# EAGLE design picoKey_230407 (EAGLE 9.6.2)
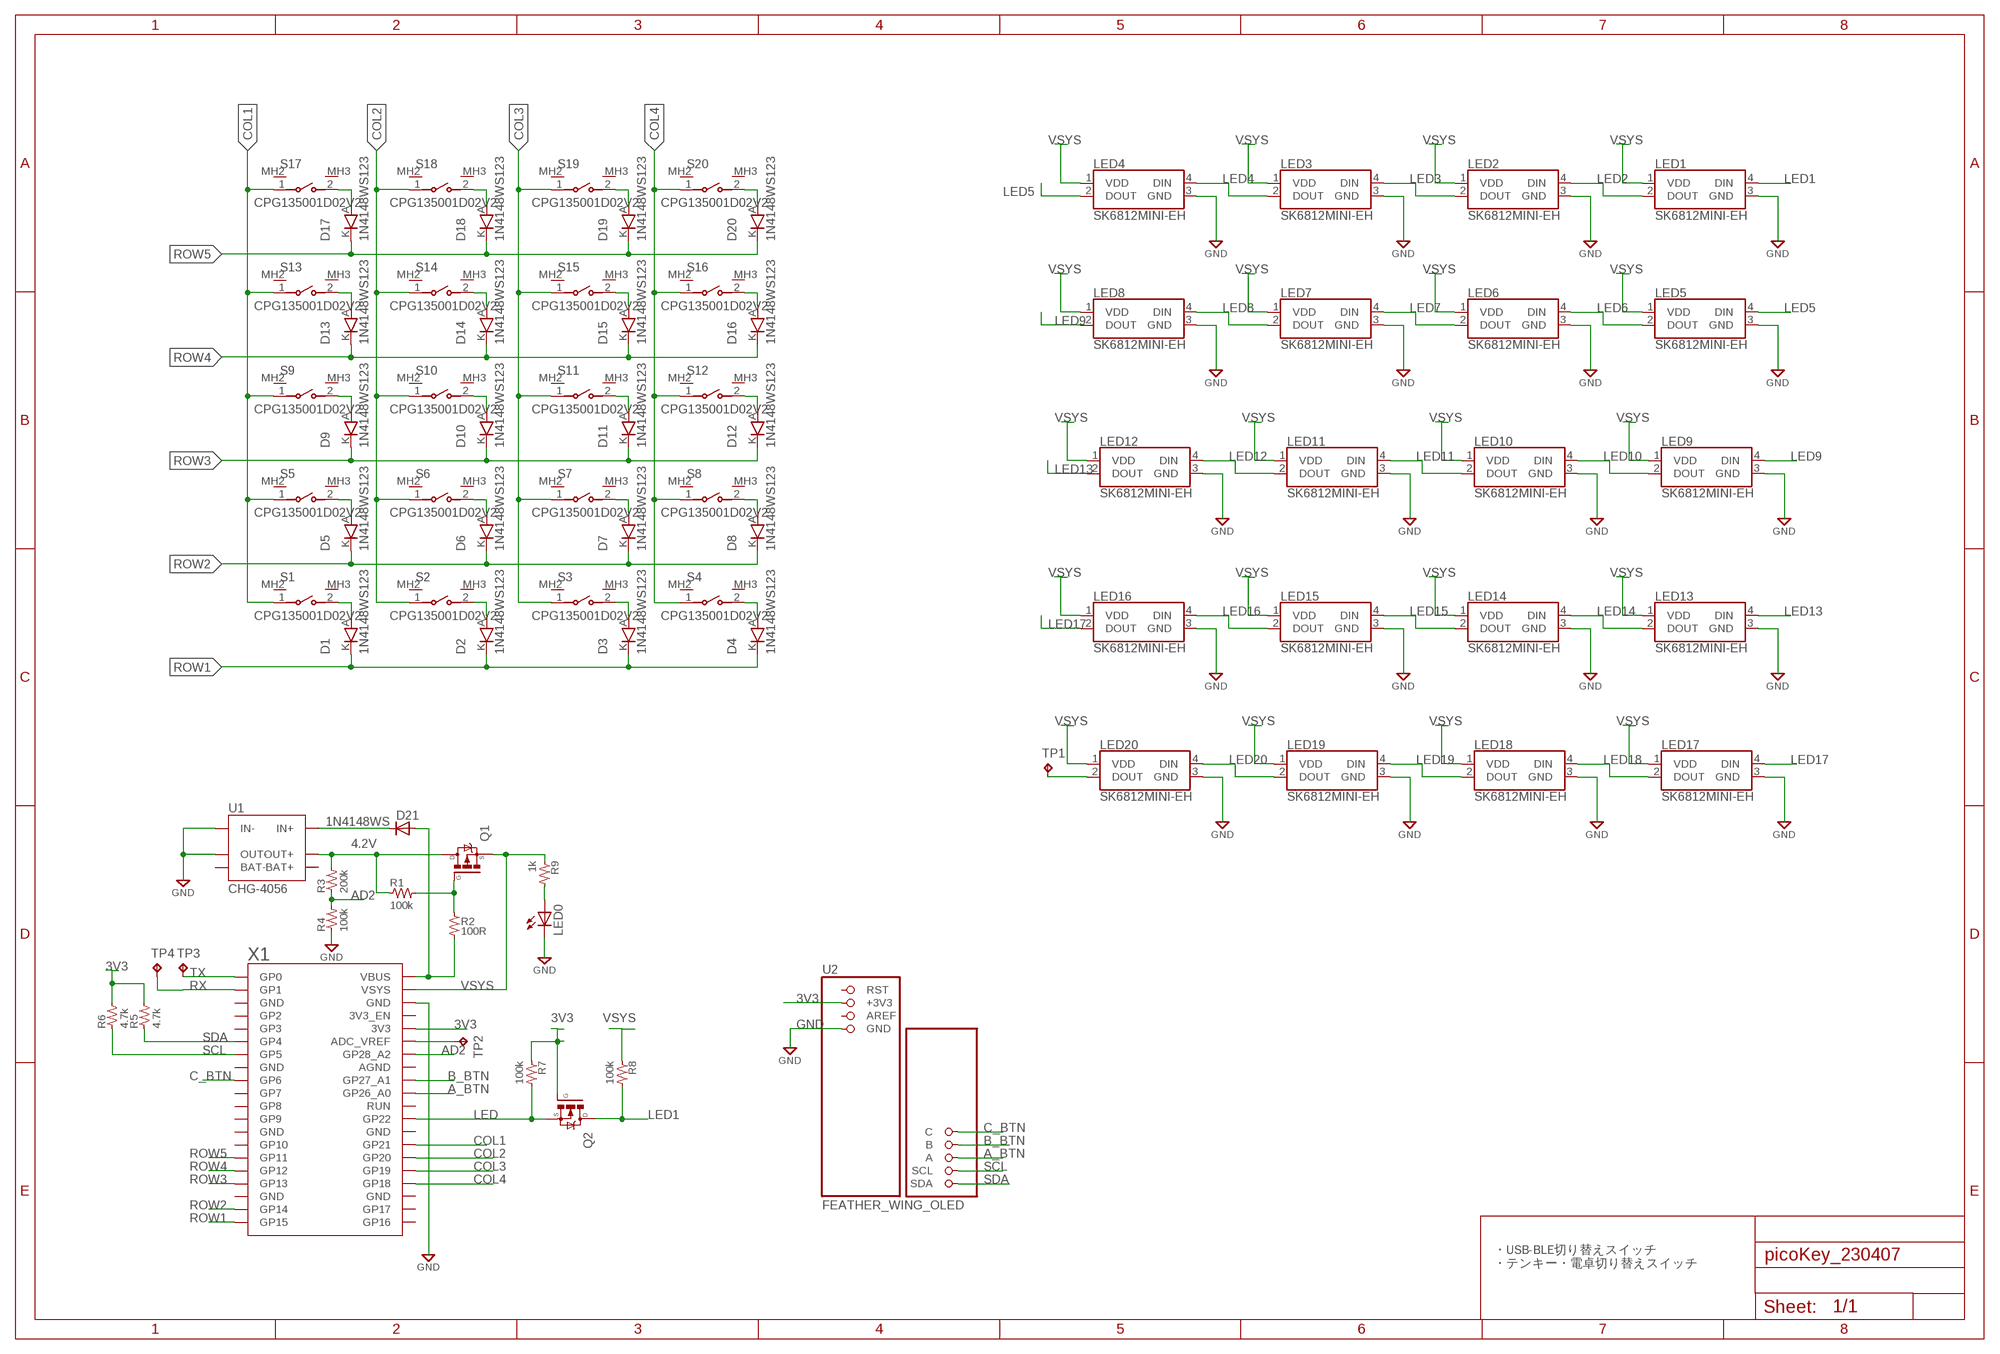
[diagram p0: schematic, sheet 1]

## Parts
D1  1N4148WS123  [SOD-123]
D2  1N4148WS123  [SOD-123]
D3  1N4148WS123  [SOD-123]
D4  1N4148WS123  [SOD-123]
D5  1N4148WS123  [SOD-123]
D6  1N4148WS123  [SOD-123]
D7  1N4148WS123  [SOD-123]
D8  1N4148WS123  [SOD-123]
D9  1N4148WS123  [SOD-123]
D10  1N4148WS123  [SOD-123]
D11  1N4148WS123  [SOD-123]
D12  1N4148WS123  [SOD-123]
D13  1N4148WS123  [SOD-123]
D14  1N4148WS123  [SOD-123]
D15  1N4148WS123  [SOD-123]
D16  1N4148WS123  [SOD-123]
D17  1N4148WS123  [SOD-123]
D18  1N4148WS123  [SOD-123]
D19  1N4148WS123  [SOD-123]
D20  1N4148WS123  [SOD-123]
D21  1N4148WS  DIODE123  [SOD-123]
LED0  LEDCHIP-LED0603  [CHIP-LED0603]
LED1  SK6812MINI-EH  [SK6812MINIE-H]
LED2  SK6812MINI-EH  [SK6812MINIE-H]
LED3  SK6812MINI-EH  [SK6812MINIE-H]
LED4  SK6812MINI-EH  [SK6812MINIE-H]
LED5  SK6812MINI-EH  [SK6812MINIE-H]
LED6  SK6812MINI-EH  [SK6812MINIE-H]
LED7  SK6812MINI-EH  [SK6812MINIE-H]
LED8  SK6812MINI-EH  [SK6812MINIE-H]
LED9  SK6812MINI-EH  [SK6812MINIE-H]
LED10  SK6812MINI-EH  [SK6812MINIE-H]
LED11  SK6812MINI-EH  [SK6812MINIE-H]
LED12  SK6812MINI-EH  [SK6812MINIE-H]
LED13  SK6812MINI-EH  [SK6812MINIE-H]
LED14  SK6812MINI-EH  [SK6812MINIE-H]
LED15  SK6812MINI-EH  [SK6812MINIE-H]
LED16  SK6812MINI-EH  [SK6812MINIE-H]
LED17  SK6812MINI-EH  [SK6812MINIE-H]
LED18  SK6812MINI-EH  [SK6812MINIE-H]
LED19  SK6812MINI-EH  [SK6812MINIE-H]
LED20  SK6812MINI-EH  [SK6812MINIE-H]
Q1  MOSFET-P  [SOT-23]
Q2  MOSFET-NSOT-23  [SOT-23]
R1  100k  R_0603  [R0603]
R2  100R  R_0603  [R0603]
R3  200k  R_0603  [R0603]
R4  100k  R_0603  [R0603]
R5  4.7k  R_0603  [R0603]
R6  4.7k  R_0603  [R0603]
R7  100k  R_0603  [R0603]
R8  100k  R_0603  [R0603]
R9  1k  R_0603  [R0603]
S1  CPG135001D02V2  [KAILH_CHOC_V2]
S2  CPG135001D02V2  [KAILH_CHOC_V2]
S3  CPG135001D02V2  [KAILH_CHOC_V2]
S4  CPG135001D02V2  [KAILH_CHOC_V2]
S5  CPG135001D02V2  [KAILH_CHOC_V2]
S6  CPG135001D02V2  [KAILH_CHOC_V2]
S7  CPG135001D02V2  [KAILH_CHOC_V2]
S8  CPG135001D02V2  [KAILH_CHOC_V2]
S9  CPG135001D02V2  [KAILH_CHOC_V2]
S10  CPG135001D02V2  [KAILH_CHOC_V2]
S11  CPG135001D02V2  [KAILH_CHOC_V2]
S12  CPG135001D02V2  [KAILH_CHOC_V2]
S13  CPG135001D02V2  [KAILH_CHOC_V2]
S14  CPG135001D02V2  [KAILH_CHOC_V2]
S15  CPG135001D02V2  [KAILH_CHOC_V2]
S16  CPG135001D02V2  [KAILH_CHOC_V2]
S17  CPG135001D02V2  [KAILH_CHOC_V2]
S18  CPG135001D02V2  [KAILH_CHOC_V2]
S19  CPG135001D02V2  [KAILH_CHOC_V2]
S20  CPG135001D02V2  [KAILH_CHOC_V2]
TP1  TPTP06R  [TP06R]
TP2  TPTP06R  [TP06R]
TP3  TPTP06R  [TP06R]
TP4  TPTP06R  [TP06R]
U1  CHG-4056  [CHG-4056]
U2  FEATHER_WING_OLED  [FEATHER_WING_OLED]
X1  RASPBERRYPI_PICO_RPI_PICO_MY-MY  [RASPBERRYPI_PICO_RPI_PICO_MY]

## Nets
3V3: Q2.3(G) R5.2 R6.2 R7.1 U2.15(+3V3) X1.3V3
4.2V: Q1.2(D) R1.1 R3.2 U1.OUT+
A_BTN: U2.26(A) X1.GP26_A0
AD2: R3.1 R4.2 X1.GP28_A2
B_BTN: U2.25(B) X1.GP27_A1
C_BTN: U2.24(C) X1.GP6
COL1: S1.1 S5.1 S9.1 S13.1 S17.1 X1.GP21
COL2: S2.1 S6.1 S10.1 S14.1 S18.1 X1.GP20
COL3: S3.1 S7.1 S11.1 S15.1 S19.1 X1.GP19
COL4: S4.1 S8.1 S12.1 S16.1 S20.1 X1.GP18
GND: LED0.C LED1.3(GND) LED2.3(GND) LED3.3(GND) LED4.3(GND) LED5.3(GND) LED6.3(GND) LED7.3(GND) LED8.3(GND) LED9.3(GND) LED10.3(GND) LED11.3(GND) LED12.3(GND) LED13.3(GND) LED14.3(GND) LED15.3(GND) LED16.3(GND) LED17.3(GND) LED18.3(GND) LED19.3(GND) LED20.3(GND) R4.1 U1.IN- U1.OUT- U2.13(GND) X1.GND@8(GND) ; supply symbol labelled G
LED: Q2.1(S) R7.2 X1.GP22
LED1: LED1.4(DIN) Q2.2(D) R8.2
LED2: LED1.2(DOUT) LED2.4(DIN)
LED3: LED2.2(DOUT) LED3.4(DIN)
LED4: LED3.2(DOUT) LED4.4(DIN)
LED5: LED4.2(DOUT) LED5.4(DIN)
LED6: LED5.2(DOUT) LED6.4(DIN)
LED7: LED6.2(DOUT) LED7.4(DIN)
LED8: LED7.2(DOUT) LED8.4(DIN)
LED9: LED8.2(DOUT) LED9.4(DIN)
LED10: LED9.2(DOUT) LED10.4(DIN)
LED11: LED10.2(DOUT) LED11.4(DIN)
LED12: LED11.2(DOUT) LED12.4(DIN)
LED13: LED12.2(DOUT) LED13.4(DIN)
LED14: LED13.2(DOUT) LED14.4(DIN)
LED15: LED14.2(DOUT) LED15.4(DIN)
LED16: LED15.2(DOUT) LED16.4(DIN)
LED17: LED16.2(DOUT) LED17.4(DIN)
LED18: LED17.2(DOUT) LED18.4(DIN)
LED19: LED18.2(DOUT) LED19.4(DIN)
LED20: LED19.2(DOUT) LED20.4(DIN)
N$5: D1.A S1.2
N$6: D2.A S2.2
N$7: D3.A S3.2
N$8: D4.A S4.2
N$9: D5.A S5.2
N$10: D6.A S6.2
N$11: D7.A S7.2
N$12: D8.A S8.2
N$13: D9.A S9.2
N$14: D10.A S10.2
N$15: D11.A S11.2
N$16: D12.A S12.2
N$17: D13.A S13.2
N$18: D14.A S14.2
N$19: D15.A S15.2
N$20: D16.A S16.2
N$21: D17.A S17.2
N$22: D18.A S18.2
N$23: LED0.A R9.2
N$24: D20.A S20.2
N$25: D19.A S19.2
N$30: D21.A R2.2 X1.VBUS
N$32: D21.K(C) U1.IN+
N$36: Q1.3(G) R1.2 R2.1
N$38: LED20.2(DOUT) TP1.TP
N$40: TP2.TP X1.ADC_VREF
ROW1: D1.K D2.K D3.K D4.K X1.GP15
ROW2: D5.K D6.K D7.K D8.K X1.GP14
ROW3: D9.K D10.K D11.K D12.K X1.GP13
ROW4: D13.K D14.K D15.K D16.K X1.GP12
ROW5: D17.K D18.K D19.K D20.K X1.GP11
RX: TP4.TP X1.GP1
SCL: R6.1 U2.27(SCL) X1.GP5
SDA: R5.1 U2.28(SDA) X1.GP4
TX: TP3.TP X1.GP0
VSYS: LED1.1(VDD) LED2.1(VDD) LED3.1(VDD) LED4.1(VDD) LED5.1(VDD) LED6.1(VDD) LED7.1(VDD) LED8.1(VDD) LED9.1(VDD) LED10.1(VDD) LED11.1(VDD) LED12.1(VDD) LED13.1(VDD) LED14.1(VDD) LED15.1(VDD) LED16.1(VDD) LED17.1(VDD) LED18.1(VDD) LED19.1(VDD) LED20.1(VDD) Q1.1(S) R8.1 R9.1 X1.VSYS
Unconnected: S1.MH2(MH) S1.MH3(MH) S2.MH2(MH) S2.MH3(MH) S3.MH2(MH) S3.MH3(MH) S4.MH2(MH) S4.MH3(MH) S5.MH2(MH) S5.MH3(MH) S6.MH2(MH) S6.MH3(MH) S7.MH2(MH) S7.MH3(MH) S8.MH2(MH) S8.MH3(MH) S9.MH2(MH) S9.MH3(MH) S10.MH2(MH) S10.MH3(MH) S11.MH2(MH) S11.MH3(MH) S12.MH2(MH) S12.MH3(MH) S13.MH2(MH) S13.MH3(MH) S14.MH2(MH) S14.MH3(MH) S15.MH2(MH) S15.MH3(MH) S16.MH2(MH) S16.MH3(MH) S17.MH2(MH) S17.MH3(MH) S18.MH2(MH) S18.MH3(MH) S19.MH2(MH) S19.MH3(MH) S20.MH2(MH) S20.MH3(MH) U1.BAT+ U1.BAT- U2.14(AREF) U2.16(RST) X1.3V3_EN X1.AGND X1.GND@1(GND) X1.GND@2(GND) X1.GND@3(GND) X1.GND@4(GND) X1.GND@6(GND) X1.GND@7(GND) X1.GP2 X1.GP3 X1.GP7 X1.GP8 X1.GP9 X1.GP10 X1.GP16 X1.GP17 X1.RUN

## Notes on the sheet
- ・USB-BLE切り替えスイッチ
  ・テンキー・電卓切り替えスイッチ

## Library data of the parts
D1-D20 = SamacSys_Parts:1N4148WS: ON Semiconductor Switching Diode, 300mA 75V, 2-Pin SOD-323 1N4148WS Source: Datasheet
D21 = Miya_IC:DIODE: Diode
LED0 = Miya_IC:LED: LED OSRAM: - CHIPLED LG R971, LG N971, LY N971, LG Q971, LY Q971, LO R971, LY R971 LH N974, LH R974 LS Q976, LO Q976, LY Q976 LO Q996 - Hyper CHIPLED LW Q18S LB Q993, LB Q99A, LB R99A - SideLED LS A670, LO A670, LY A670, LG A670, LP A670 LB A673, LV A673, LT A673, LW A673 LH A674 LY A675 LS A676, LA A676, LO A676, LY A676, LW A676 LS A679, LY A679, LG A679 - Hyper Micro SIDELED® LS Y876, LA Y876, LO Y876, LY Y876 LT Y87S - SmartLED LW L88C, LW L88S LB L89C, LB L89S, LG L890 LS L89K, LO L89K, LY L89K LS L896, LA L896, LO L896, LY L896 - TOPLED LS T670, LO T670, LY T670, LG T670, LP T670 LSG T670, LSP T670, LSY T670, LOP T670, LYG T670 LG T671, LOG T671, LSG T671 LB T673, LV T673, LT T673, LW T673 LH T674 LS T676, LA T676, LO T676, LY T676, LB T676, LH T676, LSB T676, LW T676 LB T67C, LV T67C, LT T67C, LS T67K, LO T67K, LY T67K, LW E67C LS E67B, LA E67B, LO E67B, LY E67B, LB E67C, LV E67C, LT E67C LW T67C LS T679, LY T679, LG T679 LS T770, LO T770, LY T770, LG T770, LP T770 LB T773, LV T773, LT T773, LW T773 LH T774 LS E675, LA E675, LY E675, LS T675 LS T776, LA T776, LO T776, LY T776, LB T776 LHGB T686 LT T68C, LB T68C - Hyper Mini TOPLED® LB M676 - Mini TOPLED Santana® LG M470 LS M47K, LO M47K, LY M47K Source: http://www.osram.convergy.de - LUMILED® LXK2-PW12-R00, LXK2-PW12-S00, LXK2-PW14-U00, LXK2-PW14-V00 LXK2-PM12-R00, LXK2-PM12-S00, LXK2-PM14-U00 LXK2-PE12-Q00, LXK2-PE12-R00, LXK2-PE12-S00, LXK2-PE14-T00, LXK2-PE14-U00 LXK2-PB12-K00, LXK2-PB12-L00, LXK2-PB12-M00, LXK2-PB14-N00, LXK2-PB14-P00, LXK2-PB14-Q00 LXK2-PR12-L00, LXK2-PR12-M00, LXK2-PR14-Q00, LXK2-PR14-R00 LXK2-PD12-Q00, LXK2-PD12-R00, LXK2-PD12-S00 LXK2-PH12-R00, LXK2-PH12-S00 LXK2-PL12-P00, LXK2-PL12-Q00, LXK2-PL12-R00 Source: www.luxeon.com
LED1-LED20 = picoKey:SK6812MINI-E: 3.2x2.8x1.78 mm 0.2W Intelligent external control surface mount SMD LED (MSL:5a) Source: Datasheet <http://yushakobo.jp/ds/YS-SK6812MINI-E.pdf>
Q1 = Miya_IC:MOSFET-P: P-CHANNEL HEXFET POWER-MOS-FET Source: http://www.irf.com/product-info/datasheets/data/irf9530.pdf
Q2 = Miya_IC:MOSFET-N: HEXFET Power MOSFET
R1-R9 = Miya_IC:R_: RESISTOR
S1-S20 = picoKey:CPG135001D02: Through Hole Tactile Switches RoHS Source: Datasheet <https://datasheet.lcsc.com/szlcsc/1910111742_Kailh-CPG135001D02_C400230.pdf>
TP1-TP4 = testpad:TP: Test pad
U1 = picoKey:CHG-4056
U2 = picoKey:FEATHER_WING_OLED
X1 = picoKey:RASPBERRYPI_PICO_RPI_PICO_MY

## Board
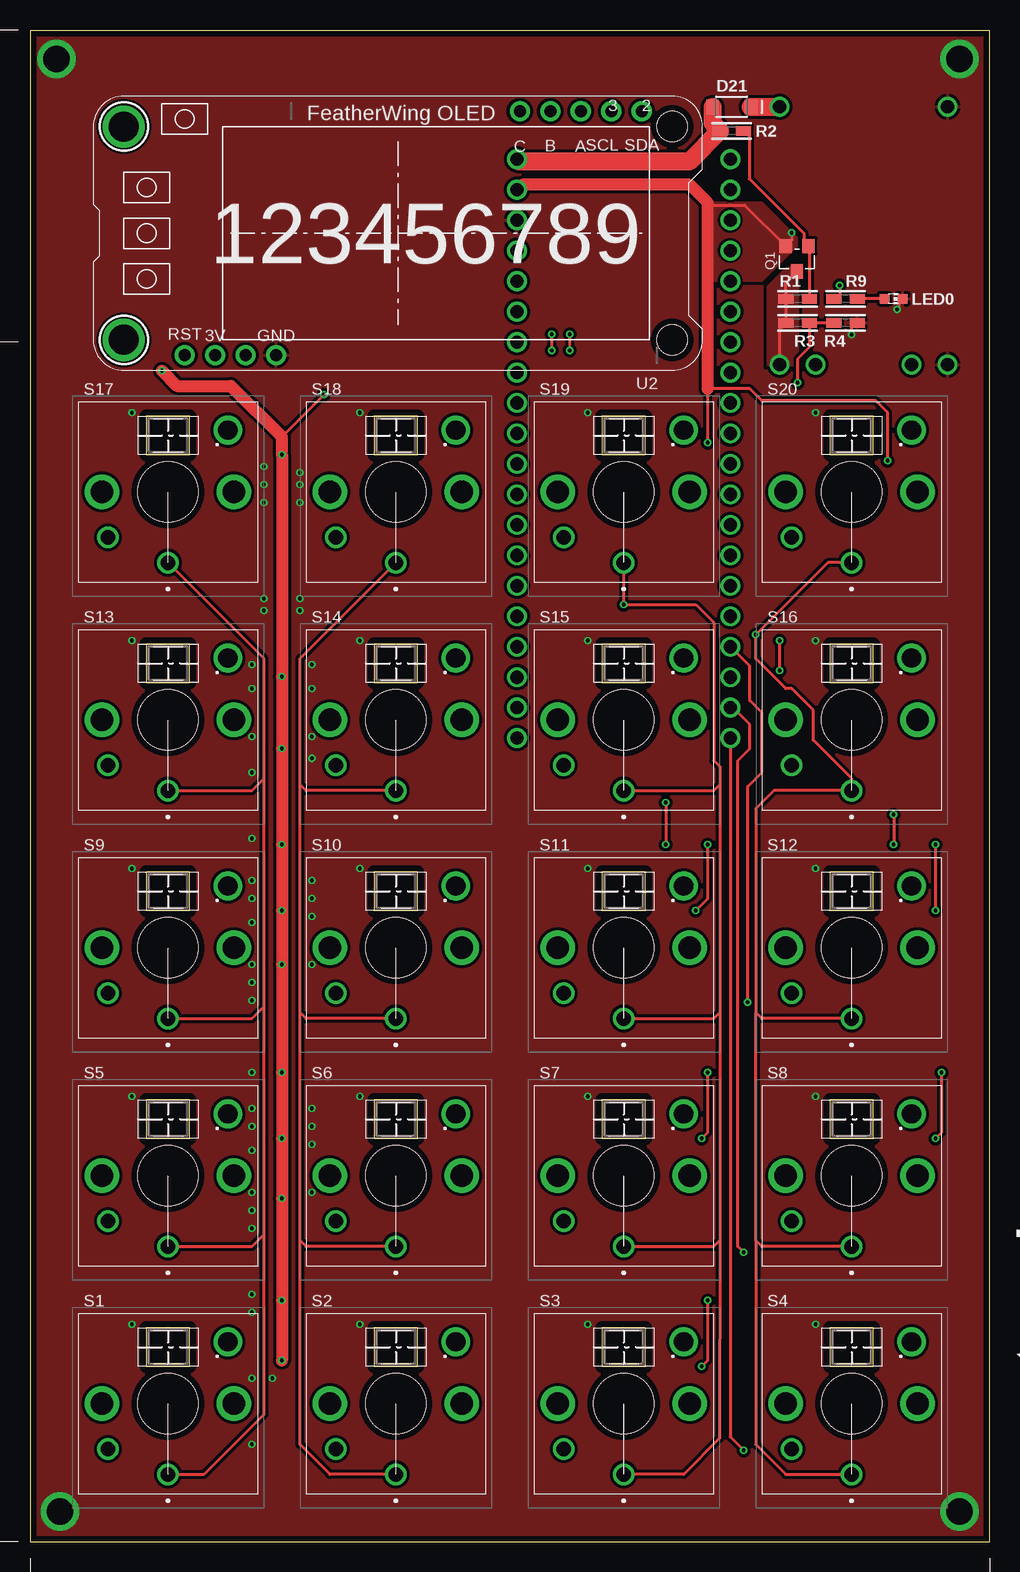
[diagram p1: board, top side]
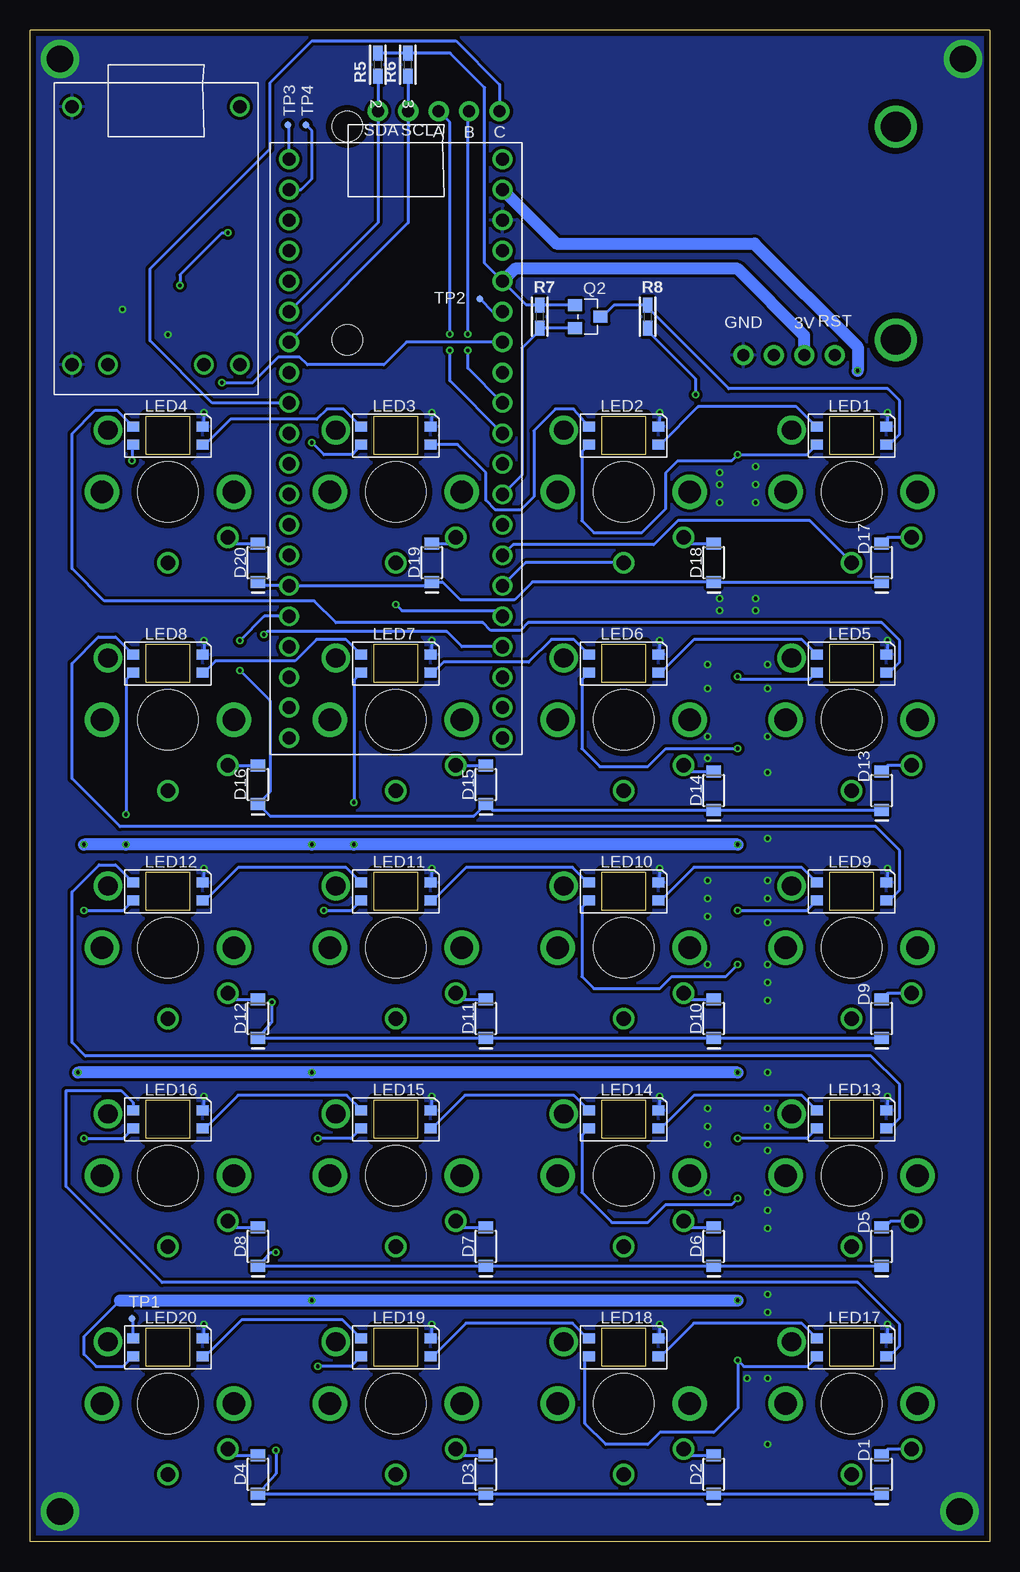
[diagram p2: board, bottom side, seen from below]

Size 80 x 126 mm. Coordinates in mm from the lower left corner, seen from the top.
Outline: 0,0 80,0 80,126 0,126 0,0
Copper layers (1*16): Top 0.035mm / dielectric 1.6mm / Bottom 0.035mm
Design rules "Elecrow_2-layer_PCB_eagle_rule": minimum track width 6mil, minimum drill 12mil, track to track 6mil, track to pad 8mil, pad to pad 12mil, via to via 12mil, smd to smd 0mil, copper to edge 20mil, drill to drill 10mil, minimum pad ring 6mil, minimum via ring 6mil, stop-mask expansion 0mil, vias tented up to drill 100mil, thermal gap 10mil

### Footprints (pad centres in the part's own frame; a part is rotated, then mirrored left to right if it is on the bottom)
SOD-123 = smd 1 x 1.2: A 1.6,0; K -1.6,0
SOD-123' = smd 1.2 x 1: A 0,-1.6; K 0,1.6
CHIP-LED0603 = smd 0.8 x 0.8: A 0,-0.75; C 0,0.75
SK6812MINIE-H = smd 1 x 0.82: 1 2.9,0.75; 2 2.9,-0.75; 3 -2.9,-0.75; 4 -2.9,0.75
SOT-23 = smd 1.016 x 1.2: 1 0.95,-1.06; 2 0,1.06; 3 -0.95,-1.06
R0603 = smd 1.25 x 0.8: 1 -0.965,0; 2 0.965,0
KAILH_CHOC_V2 = drill 1.2: 1 0,0; 2 -5,2.1 | drill 1.6: MH1 5,11.05 | drill 1.9: MH2 5.5,5.9; MH3 -5.5,5.9 | hole 5: 0,5.9
TP06R = smd 0.6 x 0.6: TP 0,0
CHG-4056 = drill 1.1 pad 1.6: BAT+ 4,-10.5; BAT- -4,-10.5; IN+ 7,11; IN- -7,11; OUT+ 7,-10.5; OUT- -7,-10.5
FEATHER_WING_OLED = drill 1 pad 1.676: 13 -30.48,0; 14 -33.02,0; 15 -35.56,0; 16 -38.1,0; 24 -10.16,20.32; 25 -7.62,20.32; 26 -5.08,20.32; 27 -2.54,20.32; 28 0,20.32 | drill 2.5 pad 3.2: P$1 -43.18,19.05; P$2 -43.18,1.27 | hole 2.54: 2.54,19.05; 2.54,1.27
RASPBERRYPI_PICO_RPI_PICO_MY = drill 1.1 pad 1.6: 3V3 8.89,13.97; 3V3_EN 8.89,16.51; ADC_VREF 8.89,11.43; AGND 8.89,6.35; GND@1 -8.89,19.05; GND@2 -8.89,6.35; GND@3 -8.89,-6.35; GND@4 -8.89,-19.05; GND@6 8.89,-19.05; GND@7 8.89,-6.35; GND@8 8.89,19.05; GP0 -8.89,24.13; GP1 -8.89,21.59; GP2 -8.89,16.51; GP3 -8.89,13.97; GP4 -8.89,11.43; GP5 -8.89,8.89; GP6 -8.89,3.81; GP7 -8.89,1.27; GP8 -8.89,-1.27; GP9 -8.89,-3.81; GP10 -8.89,-8.89; GP11 -8.89,-11.43; GP12 -8.89,-13.97; GP13 -8.89,-16.51; GP14 -8.89,-21.59; GP15 -8.89,-24.13; GP16 8.89,-24.13; GP17 8.89,-21.59; GP18 8.89,-16.51; GP19 8.89,-13.97; GP20 8.89,-11.43; GP21 8.89,-8.89; GP22 8.89,-3.81; GP26_A0 8.89,1.27; GP27_A1 8.89,3.81; GP28_A2 8.89,8.89; RUN 8.89,-1.27; VBUS 8.89,24.13; VSYS 8.89,21.59

### Placement (x,y rotation side)
D1  9,5.6 90 bottom
D2  23,5.6 90 bottom
D3  42,5.6 90 bottom
D4  61,5.6 90 bottom
D5  9,24.6 90 bottom
D6  23,24.6 90 bottom
D7  42,24.6 90 bottom
D8  61,24.6 90 bottom
D9  9,43.6 90 bottom
D10  23,43.6 90 bottom
D11  42,43.6 90 bottom
D12  61,43.6 90 bottom
D13  9,62.6 90 bottom
D14  23,62.6 90 bottom
D15  42,63.1 90 bottom
D16  61,63.1 90 bottom
D17  9,81.6 90 bottom
D18  23,81.6 90 bottom
D19  46.5,81.6 90 bottom
D20  61,81.6 90 bottom
D21  1N4148WS  [SOD-123']  58.5,119.6 270 top
LED0  72,103.6 270 top
LED1  11.5,92.2 180 bottom
LED2  30.5,92.2 180 bottom
LED3  49.5,92.2 180 bottom
LED4  68.5,92.2 180 bottom
LED5  11.5,73.2 180 bottom
LED6  30.5,73.2 180 bottom
LED7  49.5,73.2 180 bottom
LED8  68.5,73.2 180 bottom
LED9  11.5,54.2 180 bottom
LED10  30.5,54.2 180 bottom
LED11  49.5,54.2 180 bottom
LED12  68.5,54.2 180 bottom
LED13  11.5,35.2 180 bottom
LED14  30.5,35.2 180 bottom
LED15  49.5,35.2 180 bottom
LED16  68.5,35.2 180 bottom
LED17  11.5,16.2 180 bottom
LED18  30.5,16.2 180 bottom
LED19  49.5,16.2 180 bottom
LED20  68.5,16.2 180 bottom
Q1  63.95,106.92 180 top
Q2  33.5,102.1 270 bottom
R1  64,103.6 0 top
R2  58.5,117.6 180 top
R3  64,101.6 180 top
R4  68,101.6 180 top
R5  51,123.1 90 bottom
R6  48.5,123.1 90 bottom
R7  37.5,102.1 270 bottom
R8  28.5,102.1 90 bottom
R9  68,103.6 0 top
S1  11.5,5.6 0 top
S2  30.5,5.6 0 top
S3  49.5,5.6 0 top
S4  68.5,5.6 0 top
S5  11.5,24.6 0 top
S6  30.5,24.6 0 top
S7  49.5,24.6 0 top
S8  68.5,24.6 0 top
S9  11.5,43.6 0 top
S10  30.5,43.6 0 top
S11  49.5,43.6 0 top
S12  68.5,43.6 0 top
S13  11.5,62.6 0 top
S14  30.5,62.6 0 top
S15  49.5,62.6 0 top
S16  68.5,62.6 0 top
S17  11.5,81.6 0 top
S18  30.5,81.6 0 top
S19  49.5,81.6 0 top
S20  68.5,81.6 0 top
TP1  71.5,18.6 0 bottom
TP2  42.5,103.6 0 bottom
TP3  58.5,118.1 90 bottom
TP4  57,118.1 90 bottom
U1  69.5,108.6 0 bottom
U2  51,98.9 0 top
X1  49.5,91.1 0 bottom

### Tracks (layer width: path | path; a pad name or v marks a point on that pad's centre or on a via)
3V3
  Bottom 0.25: Q2.3 34.58,103.06 R7.1 38.6,103.06 X1.3V3 42.1,106.56 42.1,121.2 44.97,124.06 R6.2 R5.2
  Bottom 1: U2.15 15.44,100.54 21,106.1 39.58,106.1 X1.3V3
4.2V
  Top 0.25: U1.OUT+ 62.5,101.06 R3.2 R1.1 63.03,104.94 Q1.2
  pour Top (isolate 0.2, no thermals): 61.5,98.1 64,98.1 64,106.1 63,106.1 61.5,104.6
A_BTN  (via drill 0.3)
  Top 0.25: v45,99.3 v45,100.65
  Bottom 0.25: X1.GP26_A0 45,96.76 v45,99.3 | v45,100.65 45,118.3 U2.26
AD2  (via drill 0.3)
  Top 0.25: R4.2 R3.1 64.97,99.56 64,98.6 v64,96.6
  Bottom 0.25: X1.GP28_A2 48.61,99.99 50.5,98.1 56.87,98.1 57.5,98.73 59.33,98.73 61.46,96.6 v64,96.6
B_BTN  (via drill 0.3)
  Top 0.25: v43.5,99.3 v43.5,100.65
  Bottom 0.25: X1.GP27_A1 43.5,97.8 v43.5,99.3 | v43.5,100.65 43.5,119.1 U2.25
C_BTN
  Bottom 0.25: X1.GP6 64.81,94.91 70,100.1 70,106.1 60,116.1 60,121.6 56.5,125.1 44.5,125.1 40.84,121.44 U2.24
COL1
  Top 0.25: S1.1 14.5,5.6 19.5,10.6 19.5,25.6 | S17.1 19.5,73.6 19.5,63.6 | 19.5,25.6 19.5,44.6 | 19.5,44.6 19.5,63.6 | S5.1 18.5,24.6 19.5,25.6 | S9.1 18.5,43.6 19.5,44.6 | S13.1 18.5,62.6 19.5,63.6
  Bottom 0.25: S17.1 15,85.1 26,85.1 28,83.1 39.72,83.1 X1.GP21
COL2
  Top 0.25: 22.5,25.1 22.5,44.1 | 22.5,44.1 22.5,63.1 | 22.5,63.1 22.5,73.6 S18.1 | S6.1 23,24.6 22.5,25.1 | S2.1 25,5.6 22.5,8.1 22.5,25.1 | S10.1 23,43.6 22.5,44.1 | S14.1 23,62.6 22.5,63.1
  Bottom 0.25: S18.1 38.68,81.6 X1.GP20
COL3  (via drill 0.3)
  Top 0.25: S19.1 v49.5,78.1 55.5,78.1 57,76.6 57,65.1 57.51,64.59 57.51,63.1 | S3.1 54.5,5.6 57.5,8.6 57.5,25.1 | 57.51,63.1 57.51,44.1 | 57.51,44.1 57.5,25.1 | S7.1 57,24.6 57.5,25.1 | S11.1 57.01,43.6 57.51,44.1 | S15.1 57.01,62.6 57.51,63.1
  Bottom 0.25: X1.GP19 41.08,77.6 49,77.6 v49.5,78.1
COL4  (via drill 0.3)
  Top 0.25: S20.1 66.5,81.6 v60.5,75.6 60.5,73.6 63,71.1 63.5,71.1 65.3,69.3 65.3,66.8 68.5,63.6 S16.1 62,62.6 60.5,61.1 60.5,44.1 | 60.5,25.1 60.5,8.1 63,5.6 S4.1 | S8.1 61,24.6 60.5,25.1 | S12.1 61,43.6 60.5,44.1 | 60.5,25.1 60.5,44.1
  Bottom 0.25: X1.GP18 44,74.6 45.25,75.85 60.25,75.85 v60.5,75.6
GND  (via drill 0.3, 2.2)
  Top 0.25: LED0.C 72.45,103.3 72.45,102.85 v72.3,102.7 | R4.1 68.47,101.6 68.47,100.64 v68.5,100.6
  Bottom 0.25: LED1.3 8.5,93.25 v8.5,94.1 | LED2.3 27.5,93.25 v27.5,94.1 | LED3.3 46.5,93.25 v46.5,94.1 | LED4.3 65.5,93.25 v65.5,94.1 | v65.5,75.1 65.5,74 65.55,73.95 LED8.3 | LED7.3 46.61,73.99 46.5,74.1 v46.5,75.1 | LED6.3 27.5,74.25 v27.5,75.1 | LED5.3 8.5,74.25 v8.5,75.1 | LED12.3 65.5,55.25 v65.5,56.1 | LED11.3 46.5,55.25 v46.5,56.1 | LED10.3 27.5,55.25 v27.5,56.1 | LED9.3 8.5,55.25 v8.5,56.1 | LED13.3 8.5,36.25 v8.5,37.1 | LED14.3 27.5,36.25 v27.5,37.1 | LED15.3 46.5,36.25 v46.5,37.1 | LED16.3 65.5,36.25 v65.5,37.1 | LED20.3 65.5,17.25 v65.5,18.1 | LED19.3 46.5,17.25 v46.5,18.1 | LED18.3 27.5,17.25 v27.5,18.1 | LED17.3 8.5,17.25 v8.5,18.1
  other vias: 19.5,89.6 19.5,88.1 19.5,86.6 22.5,88.1 22.5,86.6 22.5,89.1 19.5,78.6 19.5,77.6 22.5,77.6 22.5,78.6 18.5,73.1 23.5,73.1 18.5,71.1 23.5,71.1 23.5,67.1 18.5,67.1 18.5,64.1 23.5,65.3 18.5,58.6 23.5,55.1 23.5,53.6 23.5,52.1 18.5,55.1 18.5,53.6 18.5,51.6 18.5,48.1 18.5,46.6 18.5,45.1 23.5,48.1 23.5,36.1 23.5,34.6 23.5,33.1 18.5,39.1 18.5,36.1 18.5,34.6 18.5,32.6 18.5,29.1 18.5,27.6 18.5,26.1 23.5,29.1 18.5,20.6 18.5,19.1 18.5,13.6 18.5,8.1 20.2,13.6 2.2,123.6 77.5,123.6 77.5,2.5 2.5,2.5
  pour Bottom (isolate 0.254, rank 6): 80,0 80,126 0,126 0,0
  pour Top (isolate 0.254, rank 6): 0,0 0,126 80,126 80,0
LED
  Bottom 0.152: R7.2 37.5,101
  Bottom 0.25: X1.GP22 39,88.9 39,99.5 37.5,101 37.35,101.15 Q2.1
LED1
  Bottom 0.25: Q2.2 32.27,102.1 31.3,103.06 R8.2 28.5,102.86 21.73,96.1 8.5,96.1 7.5,95.1 7.5,92.3 8.35,91.45 LED1.4
LED2
  Bottom 0.25: LED1.2 14.45,92.95 16.1,94.6 24.3,94.6 27.45,91.45 LED2.4
LED3
  Bottom 0.25: LED2.2 34.67,94.4 36.2,94.4 38,92.6 38,87.1 39.1,86 41.2,86 42,86.8 42,89.1 44.35,91.45 LED3.4
LED4
  Bottom 0.25: LED3.2 53.86,94.4 55.24,94.4 56.1,93.55 63.29,93.55 65.39,91.45 LED4.4
LED5
  Bottom 0.25: LED5.4 8.35,72.45 7.5,73.3 7.5,75.1 9,76.6 38.47,76.6 39.12,75.95 41.6,75.95 42.25,76.6 54.5,76.6 56.3,78.4 73.8,78.4 76.5,81.1 76.5,92.35 74.54,94.3 72.76,94.3 LED4.2
LED6
  Bottom 0.25: LED5.2 15.66,75.2 24.64,75.2 27.39,72.45 LED6.4
LED7
  Bottom 0.25: LED6.2 34.66,75.2 36.53,75.2 38.42,73.31 45.53,73.31 46.39,72.45 LED7.4
LED8
  Bottom 0.25: LED7.2 53.66,75.2 56.11,75.2 57.9,73.41 64.53,73.41 65.49,72.45 LED8.4
LED9
  Bottom 0.25: LED9.4 8.35,53.45 7.5,54.3 7.5,57.6 9.5,59.6 72.5,59.6 76.5,63.6 76.5,73.2 74.3,75.4 72.86,75.4 LED8.2
LED10
  Bottom 0.25: LED10.4 27.4,53.45 24.65,56.2 15.66,56.2 LED9.2
LED11
  Bottom 0.25: LED10.2 33.5,54.95 34.76,56.2 43.63,56.2 46.39,53.45 LED11.4
LED12
  Bottom 0.25: LED11.2 53.66,56.2 62.63,56.2 65.39,53.45 LED12.4
LED13
  Bottom 0.25: LED13.4 8.35,34.45 7.5,35.3 7.5,38.1 9.88,40.48 75.38,40.48 76.5,41.6 76.5,54.15 74.24,56.4 72.86,56.4 LED12.2
LED14
  Bottom 0.25: LED13.2 15.66,37.2 24.64,37.2 27.39,34.45 LED14.4
LED15
  Bottom 0.25: LED15.4 46.49,34.45 43.73,37.2 34.66,37.2 LED14.2
LED16
  Bottom 0.25: LED16.4 65.4,34.45 62.65,37.2 53.6,37.2 52.4,36 LED15.2
LED17
  Bottom 0.25: LED17.4 8.35,15.45 7.5,16.3 7.5,18.1 11,21.6 69,21.6 77,29.6 77,37.6 72.4,37.6 71.4,36.6 LED16.2
LED18
  Bottom 0.25: LED17.2 15.66,18.2 24.65,18.2 27.4,15.45 LED18.4
LED19
  Bottom 0.25: LED18.2 33.5,16.95 34.76,18.2 43.65,18.2 46.4,15.45 LED19.4
LED20
  Bottom 0.25: LED19.2 53.93,18.48 62.37,18.48 65.4,15.45 LED20.4
N$5
  Bottom 0.25: S1.2 8.5,7.7 D1.A
N$6
  Bottom 0.25: S2.2 25,7.2 D2.A
N$7
  Bottom 0.25: S3.2 44,7.2 D3.A
N$8
  Bottom 0.25: S4.2 63,7.2 D4.A
N$9
  Bottom 0.25: S5.2 8.25,26.7 9,25.95 D5.A
N$10
  Bottom 0.25: S6.2 25,26.2 D6.A
N$11
  Bottom 0.25: S7.2 44,26.2 D7.A
N$12
  Bottom 0.25: S8.2 63,26.2 D8.A
N$13
  Bottom 0.25: S9.2 8.5,45.7 D9.A
N$14
  Bottom 0.25: S10.2 25,45.2 D10.A
N$15
  Bottom 0.25: S11.2 44,45.2 D11.A
N$16
  Bottom 0.25: S12.2 63,45.2 D12.A
N$17
  Bottom 0.25: D13.A 8.5,64.7 S13.2
N$18
  Bottom 0.25: S14.2 25,64.2 D14.A
N$19
  Bottom 0.25: S15.2 D15.A
N$20
  Bottom 0.25: S16.2 D16.A
N$21
  Bottom 0.25: S17.2 8.5,83.7 D17.A
N$22
  Bottom 0.25: S18.2 25,83.2 D18.A
N$23
  Top 0.25: LED0.A R9.2
N$24
  Bottom 0.25: S20.2 63,83.2 D20.A
N$25
  Bottom 0.25: D19.A 45,83.2 S19.2
N$30
  Top 1.5: D21.A 56.9,118.23 R2.2 54.97,115.03 40.81,115.03 X1.VBUS
N$32
  Top 1.5: D21.K U1.IN+
N$36
  Top 0.25: R1.2 64.97,107.71 65.18,107.72 65.02,107.86 Q1.3 64.5,108.38 64.5,109.06 59.97,113.6 59.97,117.1 R2.1
N$38
  Bottom 0.25: LED20.2 71.4,18.6 TP1.TP
N$40
  Bottom 0.25: TP2.TP 41.43,102.53 X1.ADC_VREF
ROW1  (via drill 0.3)
  Top 0.25: X1.GP15 58.39,8.71 v59.5,7.6
  Bottom 0.25: D1.K D2.K D3.K D4.K 59.5,5.66 v59.5,7.6
ROW2  (via drill 0.3)
  Top 0.25: v59.5,24.1 59,24.6 59,65.1 60,66.1 60,68.1 58.59,69.51 X1.GP14
  Bottom 0.25: D5.K D6.K D7.K D8.K 60.5,23.5 59.96,24.1 v59.5,24.1
ROW3  (via drill 0.3)
  Top 0.25: v59.84,44.95 59.84,62.94 61,64.1 61,69.1 60,70.1 60,72.98 X1.GP13
  Bottom 0.25: D9.K D10.K D11.K D12.K 59.84,43.3 v59.84,44.95
ROW4  (via drill 0.3)
  Top 0.25: v62.5,72.6 v62.5,75.1
  Bottom 0.25: D13.K D14.K 41.5,61 D15.K 43,60.5 60,60.5 D16.K 60,62.5 60,70.1 v62.5,72.6 | X1.GP12 60.47,77.13 v62.5,75.1
ROW5
  Bottom 0.25: D17.K D18.K 38.12,80 39.62,78.49 44.1,78.49 45.61,80 D19.K 46.51,79.67 X1.GP11 60.89,79.67 D20.K
RX
  Bottom 0.25: X1.GP1 57.41,112.69 56.5,113.6 56.5,117.6 TP4.TP
SCL
  Bottom 0.25: R6.1 48.5,119.26 U2.27 48.46,109.92 X1.GP5
SDA
  Bottom 0.25: R5.1 U2.28 51,109.92 X1.GP4
TX
  Bottom 0.25: X1.GP0 58.39,117.99 TP3.TP
VSYS  (via drill 0.3)
  Top 0.25: 21,92.1 v24.5,95.6 | v55.5,52.6 56.5,53.6 v56.5,58.1 | v75.5,52.6 v75.5,58.1 | v56,33.6 56.5,34.1 v56.5,39.1 | v75.5,33.6 76,34.1 v76,39.1 | v56,14.6 56.5,15.1 v56.5,20.1 | v72,60.6 v72,58.1 | v53,61.6 v53,58.1 | v56.5,91.6 56.5,96.1 60,96.1 61,95.1 70.5,95.1 71.5,94.1 v71.5,90.1 | 56.5,111.6 56.7,111.4 59.58,111.4 Q1.1 63.5,108.48 v63.5,109.1 | R9.1 67.44,103.6 67.53,103.7 67.53,104.7 v67.5,104.7
  Top 1: v21,15.1 v21,20.1 v21,28.6 v21,33.6 v21,39.1 v21,48.1 v21,52.6 v21,58.1 v21,66.1 v21,72.1 v21,90.6 21,92.1 16.77,96.33 12.25,96.33 11,97.58 v11,97.6 | X1.VSYS 41.01,113.09 55.01,113.09 56.5,111.6 56.5,96.1
  Bottom 0.25: LED17.1 14.4,15.4 15.2,14.6 20.5,14.6 v21,15.1 21,11.1 23,9.1 27.5,9.1 28.5,8.1 32,8.1 33.73,9.82 33.73,15.12 LED18.1 | LED13.1 15.25,33.6 v21,33.6 | LED9.1 15.25,52.6 v21,52.6 | v21,72.1 20.8,71.9 15,71.9 14.45,72.45 LED5.1 | LED1.1 15.25,90.6 v21,90.6 21.5,90.1 26,90.1 27,89.1 27,86.1 29,84.1 33,84.1 34,85.1 34,90.85 LED2.1 | LED14.1 34,33.85 34,29.1 31.5,26.6 28.5,26.6 27,28.1 21.5,28.1 v21,28.6 | LED10.1 34,52.85 34,47.1 33,46.1 27.5,46.1 26.5,47.1 22,47.1 v21,48.1 | LED6.1 34,71.85 34,66.1 32.5,64.6 28.5,64.6 27,66.1 v21,66.1 | LED6.1 | v24.5,95.6 24.5,96.9 28.5,100.9 R8.1 | v55.5,52.6 53.25,52.6 LED11.1 | v75.5,52.6 72.25,52.6 LED12.1 | LED15.1 53.25,33.6 v56,33.6 | LED16.1 72.25,33.6 v75.5,33.6 | LED19.1 53.25,14.6 v56,14.6 | 72.5,20.1 75.5,17.1 75.5,15.6 74.5,14.6 72.25,14.6 LED20.1 | LED8.1 72,71.85 v72,60.6 | LED7.1 52.4,72.4 53,71.8 v53,61.6 | LED3.1 53.12,90.6 55.5,90.6 v56.5,91.6 | LED4.1 71.5,91.15 v71.5,90.1 | v63.5,109.1 64,109.1 67.5,105.6 v67.5,104.7
  Bottom 1: X1.VSYS 36.11,108.19 19.59,108.19 11,99.6 v11,97.6 | v21,58.1 v53,58.1 v56.5,58.1 v72,58.1 v75.5,58.1 | v21,39.1 v56.5,39.1 v76,39.1 | 72.5,20.1 v56.5,20.1 v21,20.1
  pour Top (isolate 0.2, no thermals): 56.5,111.6 61,111.6 63.9,108.7 63.9,108 61,105.1 56.5,105.1

### Text on the board
tPlace: エンター / スタビライザー